# EAGLE design adapter (EAGLE 7.2.0)
CNAME: EARS PocketQube Flatsat Cable Adapter; CREVISION: 0.1; DESIGNER: L. Stant
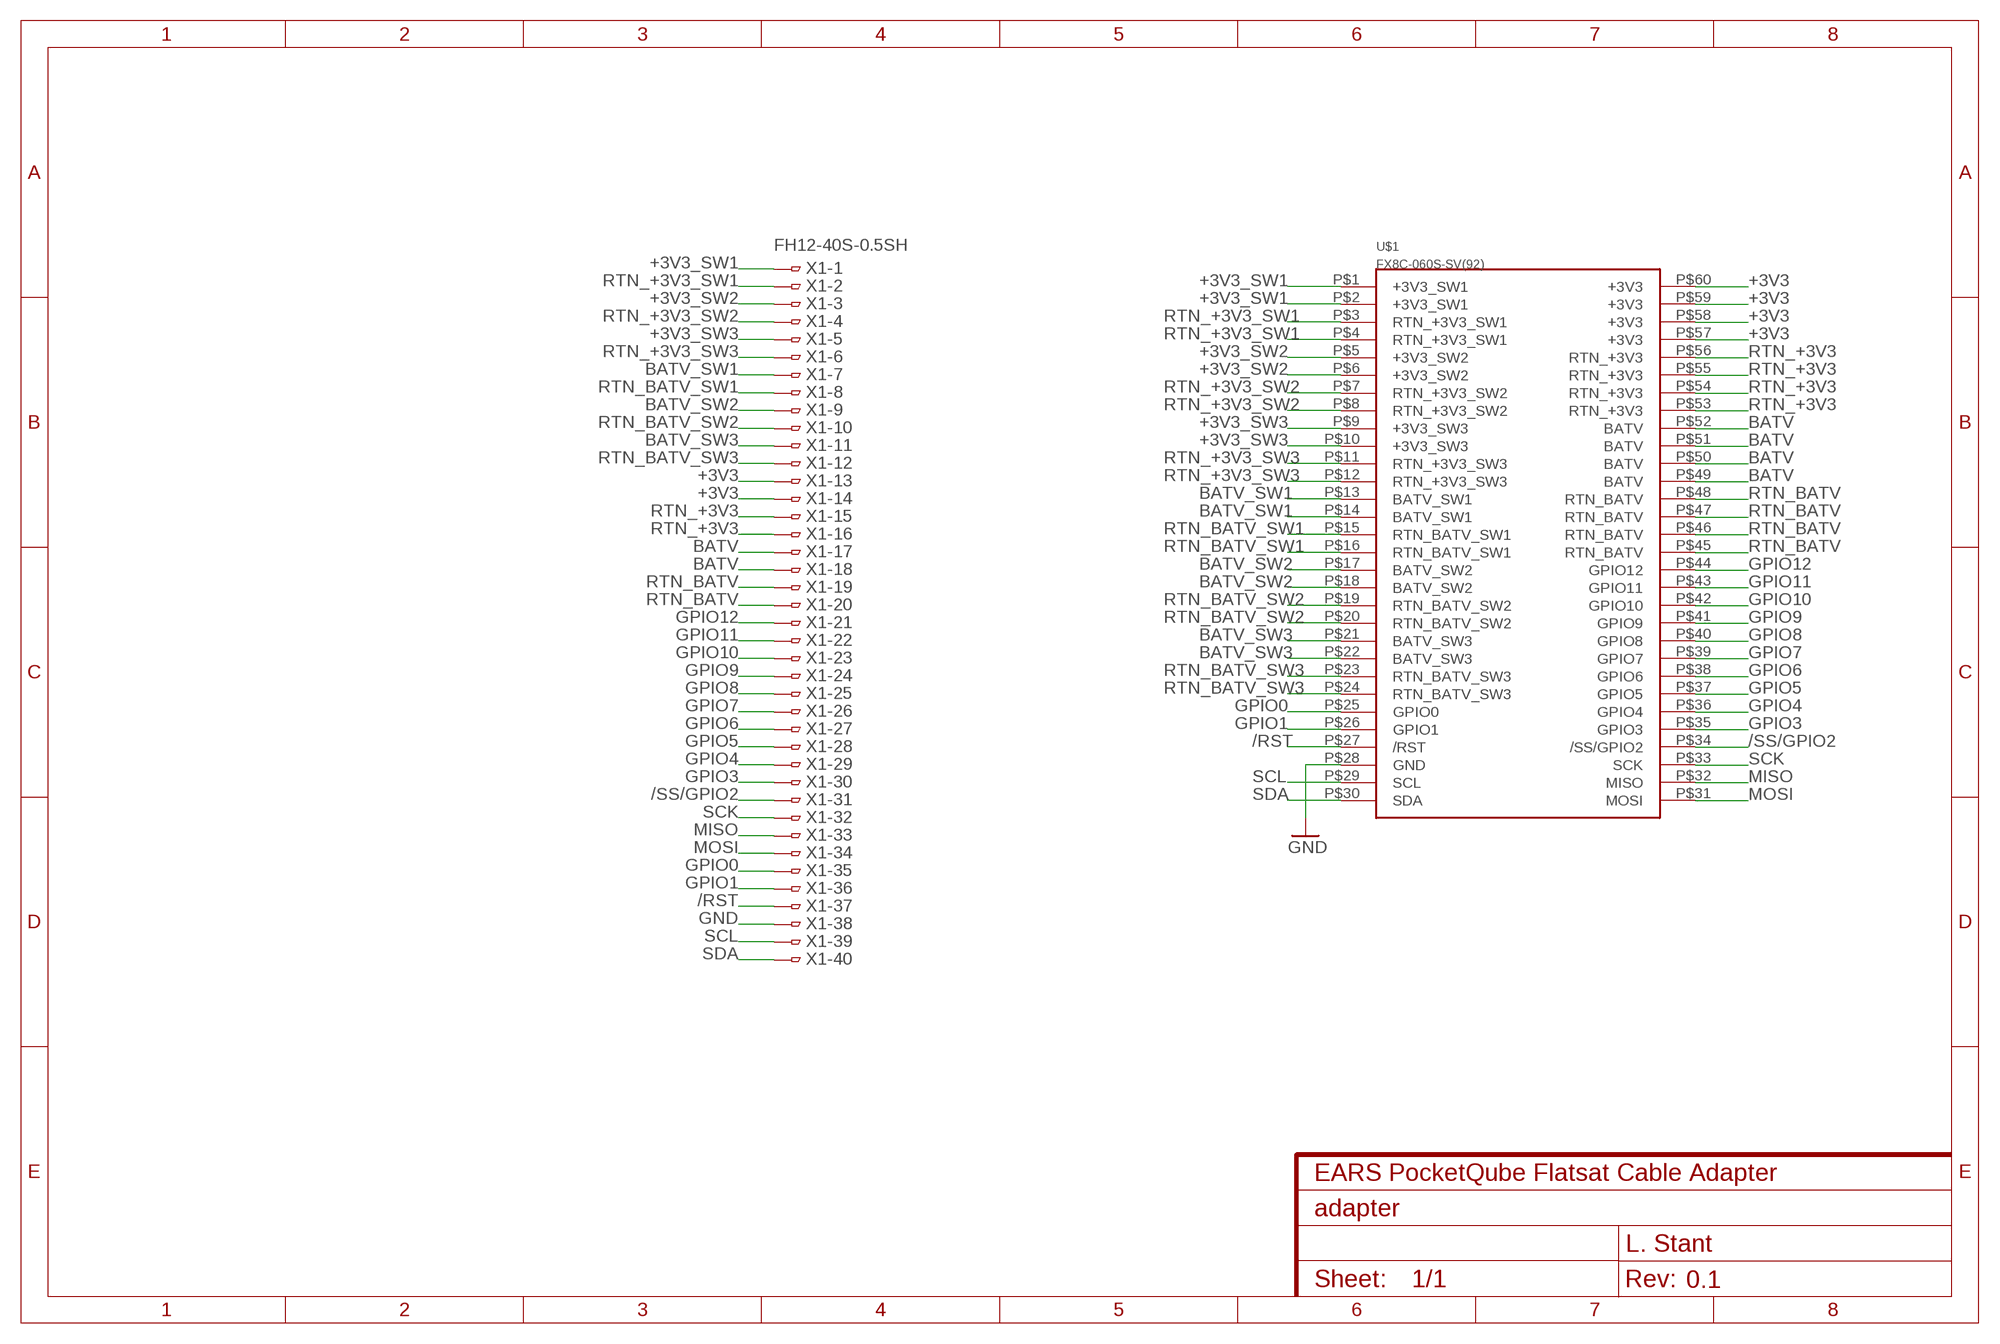
[diagram p0: schematic, sheet 1]

## Parts
U$1  FX8C-060S-SV(92)  [FX8C-060S-SV(92)]
X1  FH12-40S-0.5SH  [FH12-40S-0.5SH]

## Nets
+3V3: U$1.P$57(+3V3) U$1.P$58(+3V3) U$1.P$59(+3V3) U$1.P$60(+3V3) X1.13 X1.14
+3V3_SW1: U$1.P$1(+3V3_SW1) U$1.P$2(+3V3_SW1) X1.1
+3V3_SW2: U$1.P$5(+3V3_SW2) U$1.P$6(+3V3_SW2) X1.3
+3V3_SW3: U$1.P$9(+3V3_SW3) U$1.P$10(+3V3_SW3) X1.5
/RST: U$1.P$27(/RST) X1.37
/SS/GPIO2: U$1.P$34(/SS/GPIO2) X1.31
BATV: U$1.P$49(BATV) U$1.P$50(BATV) U$1.P$51(BATV) U$1.P$52(BATV) X1.17 X1.18
BATV_SW1: U$1.P$13(BATV_SW1) U$1.P$14(BATV_SW1) X1.7
BATV_SW2: U$1.P$17(BATV_SW2) U$1.P$18(BATV_SW2) X1.9
BATV_SW3: U$1.P$21(BATV_SW3) U$1.P$22(BATV_SW3) X1.11
GND: U$1.P$28(GND) X1.38
GPIO0: U$1.P$25(GPIO0) X1.35
GPIO1: U$1.P$26(GPIO1) X1.36
GPIO3: U$1.P$35(GPIO3) X1.30
GPIO4: U$1.P$36(GPIO4) X1.29
GPIO5: U$1.P$37(GPIO5) X1.28
GPIO6: U$1.P$38(GPIO6) X1.27
GPIO7: U$1.P$39(GPIO7) X1.26
GPIO8: U$1.P$40(GPIO8) X1.25
GPIO9: U$1.P$41(GPIO9) X1.24
GPIO10: U$1.P$42(GPIO10) X1.23
GPIO11: U$1.P$43(GPIO11) X1.22
GPIO12: U$1.P$44(GPIO12) X1.21
MISO: U$1.P$32(MISO) X1.33
MOSI: U$1.P$31(MOSI) X1.34
RTN_+3V3: U$1.P$53(RTN_+3V3) U$1.P$54(RTN_+3V3) U$1.P$55(RTN_+3V3) U$1.P$56(RTN_+3V3) X1.15 X1.16
RTN_+3V3_SW1: U$1.P$3(RTN_+3V3_SW1) U$1.P$4(RTN_+3V3_SW1) X1.2
RTN_+3V3_SW2: U$1.P$7(RTN_+3V3_SW2) U$1.P$8(RTN_+3V3_SW2) X1.4
RTN_+3V3_SW3: U$1.P$11(RTN_+3V3_SW3) U$1.P$12(RTN_+3V3_SW3) X1.6
RTN_BATV: U$1.P$45(RTN_BATV) U$1.P$46(RTN_BATV) U$1.P$47(RTN_BATV) U$1.P$48(RTN_BATV) X1.19 X1.20
RTN_BATV_SW1: U$1.P$15(RTN_BATV_SW1) U$1.P$16(RTN_BATV_SW1) X1.8
RTN_BATV_SW2: U$1.P$19(RTN_BATV_SW2) U$1.P$20(RTN_BATV_SW2) X1.10
RTN_BATV_SW3: U$1.P$23(RTN_BATV_SW3) U$1.P$24(RTN_BATV_SW3) X1.12
SCK: U$1.P$33(SCK) X1.32
SCL: U$1.P$29(SCL) X1.39
SDA: U$1.P$30(SDA) X1.40

## Library data of the parts
U$1 = Template:FX8C-060S-SV(92)
X1 = con-hirose:FH12-40S-0.5S: 0.5mm Pitch Connectors For FPC/FFC Source: Data sheet <http://www.hirose.co.jp/cataloge_hp/e58605370.pdf>; MPN: FH12-40S-0.5SH(55); OC_FARNELL: 1324556; OC_NEWARK: 34M6178

## Board
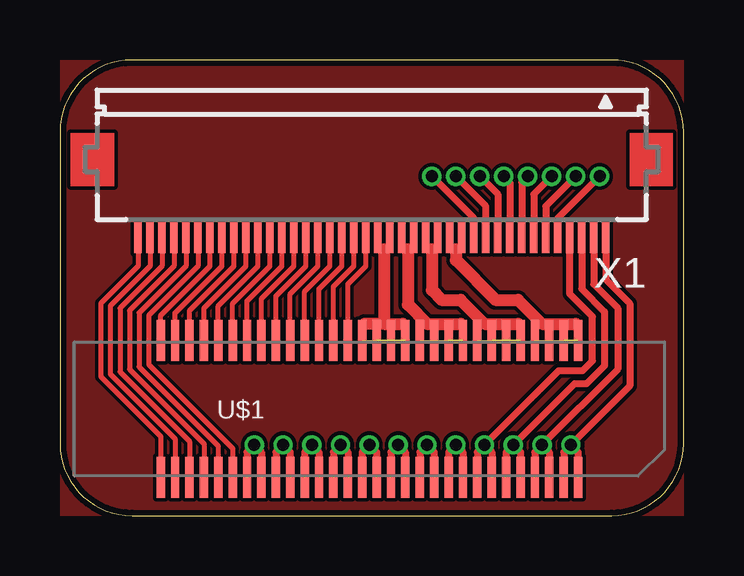
[diagram p1: board, top side]
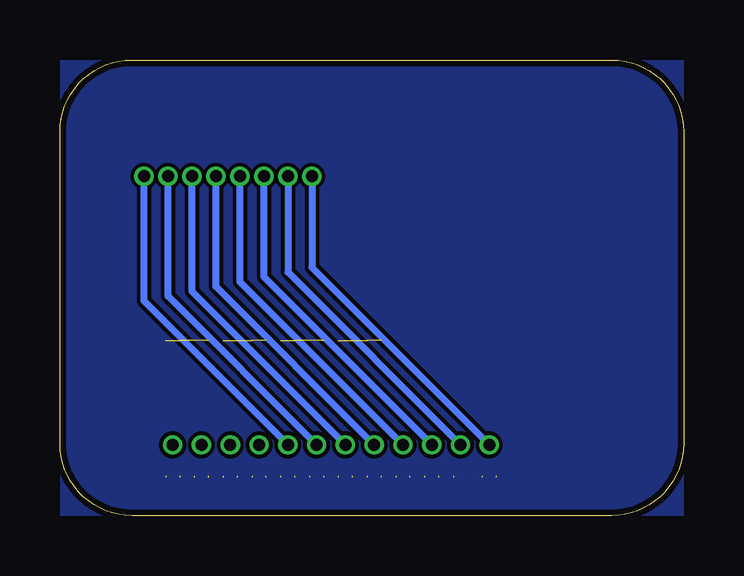
[diagram p2: board, bottom side, seen from below]

Size 26 x 19 mm. Coordinates in mm from the lower left corner, seen from the top.
Outline: 3,0 23,0 arc90 26,3 26,16 arc90 23,19 3,19 arc90 0,16 0,3 arc90 3,0
Copper layers (1*16): Top 0.035mm / dielectric 1.5mm / Bottom 0.035mm
Design rules "SeeedStudio_2layer_DRU_no_angle_20140221": minimum track width 6mil, minimum drill 12mil, track to track 6mil, track to pad 6mil, pad to pad 6mil, via to via 6mil, smd to smd 0mil, copper to edge 10mil, drill to drill 10mil, minimum pad ring 10mil, minimum via ring 6mil, stop-mask expansion 2mil, vias tented up to drill 100mil, thermal gap 10mil

### Footprints (pad centres in the part's own frame; a part is rotated, then mirrored left to right if it is on the bottom)
FX8C-060S-SV(92) = smd 0.35 x 1.7: P$1 -8.7,2.85; P$2 -8.1,2.85; P$3 -7.5,2.85; P$4 -6.9,2.85; P$5 -6.3,2.85; P$6 -5.7,2.85; P$7 -5.1,2.85; P$8 -4.5,2.85; P$9 -3.9,2.85; P$10 -3.3,2.85; P$11 -2.7,2.85; P$12 -2.1,2.85; P$13 -1.5,2.85; P$14 -0.9,2.85; P$15 -0.3,2.85; P$16 0.3,2.85; P$17 0.9,2.85; P$18 1.5,2.85; P$19 2.1,2.85; P$20 2.7,2.85; P$21 3.3,2.85; P$22 3.9,2.85; P$23 4.5,2.85; P$24 5.1,2.85; P$25 5.7,2.85; P$26 6.3,2.85; P$27 6.9,2.85; P$28 7.5,2.85; P$29 8.1,2.85; P$30 8.7,2.85; P$31 8.7,-2.85; P$32 8.1,-2.85; P$33 7.5,-2.85; P$34 6.9,-2.85; P$35 6.3,-2.85; P$36 5.7,-2.85; P$37 5.1,-2.85; P$38 4.5,-2.85; P$39 3.9,-2.85; P$40 3.3,-2.85; P$41 2.7,-2.85; P$42 2.1,-2.85; P$43 1.5,-2.85; P$44 0.9,-2.85; P$45 0.3,-2.85; P$46 -0.3,-2.85; P$47 -0.9,-2.85; P$48 -1.5,-2.85; P$49 -2.1,-2.85; P$50 -2.7,-2.85; P$51 -3.3,-2.85; P$52 -3.9,-2.85; P$53 -4.5,-2.85; P$54 -5.1,-2.85; P$55 -5.7,-2.85; P$56 -6.3,-2.85; P$57 -6.9,-2.85; P$58 -7.5,-2.85; P$59 -8.1,-2.85; P$60 -8.7,-2.85
FH12-40S-0.5SH = smd 0.3 x 1.3: 1 -9.75,3.25; 2 -9.25,3.25; 3 -8.75,3.25; 4 -8.25,3.25; 5 -7.75,3.25; 6 -7.25,3.25; 7 -6.75,3.25; 8 -6.25,3.25; 9 -5.75,3.25; 10 -5.25,3.25; 11 -4.75,3.25; 12 -4.25,3.25; 13 -3.75,3.25; 14 -3.25,3.25; 15 -2.75,3.25; 16 -2.25,3.25; 17 -1.75,3.25; 18 -1.25,3.25; 19 -0.75,3.25; 20 -0.25,3.25; 21 0.25,3.25; 22 0.75,3.25; 23 1.25,3.25; 24 1.75,3.25; 25 2.25,3.25; 26 2.75,3.25; 27 3.25,3.25; 28 3.75,3.25; 29 4.25,3.25; 30 4.75,3.25; 31 5.25,3.25; 32 5.75,3.25; 33 6.25,3.25; 34 6.75,3.25; 35 7.25,3.25; 36 7.75,3.25; 37 8.25,3.25; 38 8.75,3.25; 39 9.25,3.25; 40 9.75,3.25

### Placement (x,y rotation side)
U$1  12.9,4.45 180 top
X1  13,14.85 180 top

### Tracks (layer width: path | path; a pad name or v marks a point on that pad's centre or on a via)
+3V3  (3 unrouted)
  Top 0.2: X1.14 16.25,11.3 16.5,11.05 | X1.13 16.75,11.35 16.5,11.1 | U$1.P$60 21.6,7.9 21.5,8
  Top 0.5: 16.5,11.1 16.5,11.05 16.5,10.65 18.15,9 19.1,9 20.1,8 21.5,8
+3V3_SW1  (via drill 0.5)  (2 unrouted)
  Top 0.3: v21.3,2.95 21.6,2.65 21.6,1.65 | v21.3,2.95 21,2.65 21,1.65 | X1.1 22.75,9.85 23.75,8.85 23.75,5.4 v21.3,2.95
+3V3_SW2  (via drill 0.5)  (2 unrouted)
  Top 0.3: v18.9,2.95 19.2,2.65 19.2,1.65 | v18.9,2.95 18.6,2.65 18.6,1.65 | X1.3 21.75,9.45 22.7,8.5 22.7,6.25 21.95,5.5 21.45,5.5 v18.9,2.95
+3V3_SW3  (via drill 0.5)  (2 unrouted)
  Top 0.3: 16.8,1.65 16.8,2.65 v16.5,2.95 16.2,2.65 16.2,1.65 | v22.5,14.15 20.75,12.4 X1.5
  Bottom 0.3: v16.5,2.95 22.5,8.95 v22.5,14.15
/RST
  Top 0.2: X1.37 4.75,10.4 2.9,8.55 2.9,6.1 6,3 U$1.P$27
/SS/GPIO2
  Top 0.2: U$1.P$34 6,8.65 7.75,10.4 X1.31
BATV  (3 unrouted)
  Top 0.2: X1.18 14.25,11.35 14.5,11.1 14.75,11.35 X1.17 | U$1.P$52 16.8,7.9 16.7,8
  Top 0.5: 14.5,11.1 14.5,8.8 15.3,8 16.7,8
BATV_SW1  (via drill 0.5)  (2 unrouted)
  Top 0.3: 14.4,1.65 14.4,2.65 v14.1,2.95 13.8,2.65 13.8,1.65 | v20.5,14.15 19.75,13.4 X1.7
  Bottom 0.3: v14.1,2.95 20.5,9.35 v20.5,14.15
BATV_SW2  (via drill 0.5)  (2 unrouted)
  Top 0.3: 12,1.65 12,2.65 v11.7,2.95 11.4,2.65 11.4,1.65 | v18.5,14.15 18.75,13.9 X1.9
  Bottom 0.3: v11.7,2.95 18.5,9.75 v18.5,14.15
BATV_SW3  (via drill 0.5)  (1 unrouted)
  Top 0.3: 9.6,1.65 9.6,2.65 v9.3,2.95 9,2.65 U$1.P$22 | X1.11 17.75,12.9 v16.5,14.15
  Bottom 0.3: v16.5,14.15 16.5,10.15 v9.3,2.95
BOARD
  pour Bottom: 0,19 26,19 26,0 0,0
  pour Top: 0,19 26,19 26,0 0,0
GND
  Top 0.2: X1.38 4.25,10.4 2.5,8.65 2.5,6 5.4,3.1 U$1.P$28
GPIO0
  Top 0.2: X1.35 5.75,10.4 3.7,8.35 3.7,6.3 7.2,2.8 U$1.P$25
GPIO1
  Top 0.2: X1.36 5.25,10.4 3.3,8.45 3.3,6.2 6.6,2.9 U$1.P$26
GPIO3
  Top 0.2: U$1.P$35 6.6,8.75 8.25,10.4 X1.30
GPIO4
  Top 0.2: U$1.P$36 7.2,8.85 8.75,10.4 X1.29
GPIO5
  Top 0.2: U$1.P$37 7.8,8.95 9.25,10.4 X1.28
GPIO6
  Top 0.2: U$1.P$38 8.4,9.05 9.75,10.4 X1.27
GPIO7
  Top 0.2: U$1.P$39 9,9.15 10.25,10.4 X1.26
GPIO8
  Top 0.2: U$1.P$40 9.6,9.25 10.75,10.4 X1.25
GPIO9
  Top 0.2: U$1.P$41 10.2,9.35 11.25,10.4 X1.24
GPIO10
  Top 0.2: U$1.P$42 10.8,9.45 11.75,10.4 X1.23
GPIO11
  Top 0.2: U$1.P$43 11.4,9.55 12.25,10.4 X1.22
GPIO12
  Top 0.2: U$1.P$44 12,9.65 12.75,10.4 X1.21
MISO
  Top 0.2: U$1.P$32 4.8,8.45 6.75,10.4 X1.33
MOSI
  Top 0.2: U$1.P$31 4.2,8.35 6.25,10.4 X1.34
RTN_+3V3  (3 unrouted)
  Top 0.2: X1.16 15.25,11.35 15.5,11.1 15.75,11.35 X1.15 | U$1.P$56 19.2,7.9 19.1,8
  Top 0.5: 15.5,11.1 15.5,9.4 15.9,9 16.7,9 17.7,8 19.1,8
RTN_+3V3_SW1  (via drill 0.5)  (2 unrouted)
  Top 0.3: v20.1,2.95 20.4,2.65 20.4,1.65 | v20.1,2.95 19.8,2.65 19.8,1.65 | X1.2 22.25,9.65 23.25,8.65 23.25,6.1 v20.1,2.95
RTN_+3V3_SW2  (via drill 0.5)  (2 unrouted)
  Top 0.3: v17.7,2.95 18,2.65 18,1.65 | v17.7,2.95 17.4,2.65 17.4,1.65 | v17.7,2.95 20.8,6.05 21.8,6.05 22.2,6.45 22.2,8.3 21.25,9.25 X1.4
RTN_+3V3_SW3  (via drill 0.5)  (2 unrouted)
  Top 0.3: 15.6,1.65 15.6,2.65 v15.3,2.95 15,2.65 15,1.65 | v21.5,14.15 20.25,12.9 X1.6
  Bottom 0.3: v15.3,2.95 21.5,9.15 v21.5,14.15
RTN_BATV  (3 unrouted)
  Top 0.2: X1.20 13.25,11.25 13.5,11 | X1.19 13.75,11.35 13.5,11.1 | U$1.P$48 14.4,7.9 14.3,8
  Top 0.5: 13.5,11.1 13.5,11 13.5,8 | 13.5,8 14.3,8 | 13.5,8 12.7,8
RTN_BATV_SW1  (via drill 0.5)  (2 unrouted)
  Top 0.3: 13.2,1.65 13.2,2.65 v12.9,2.95 12.6,2.65 12.6,1.65 | v19.5,14.15 19.25,13.9 X1.8
  Bottom 0.3: v12.9,2.95 19.5,9.55 v19.5,14.15
RTN_BATV_SW2  (via drill 0.5)  (2 unrouted)
  Top 0.3: 10.8,1.65 10.8,2.65 v10.5,2.95 10.2,2.65 10.2,1.65 | v17.5,14.15 18.25,13.4 X1.10
  Bottom 0.3: v10.5,2.95 17.5,9.95 v17.5,14.15
RTN_BATV_SW3  (via drill 0.5)  (2 unrouted)
  Top 0.3: 8.4,1.65 8.4,2.65 v8.1,2.95 7.8,2.65 7.8,1.65 | X1.12 17.25,12.4 v15.5,14.15
  Bottom 0.3: v15.5,14.15 15.5,10.35 v8.1,2.95
SCK
  Top 0.2: U$1.P$33 5.4,8.55 7.25,10.4 X1.32
SCL
  Top 0.2: X1.39 3.75,10.4 2.1,8.75 2.1,5.9 4.8,3.2 U$1.P$29
SDA
  Top 0.2: X1.40 3.25,10.4 1.7,8.85 1.7,5.8 4.2,3.3 U$1.P$30